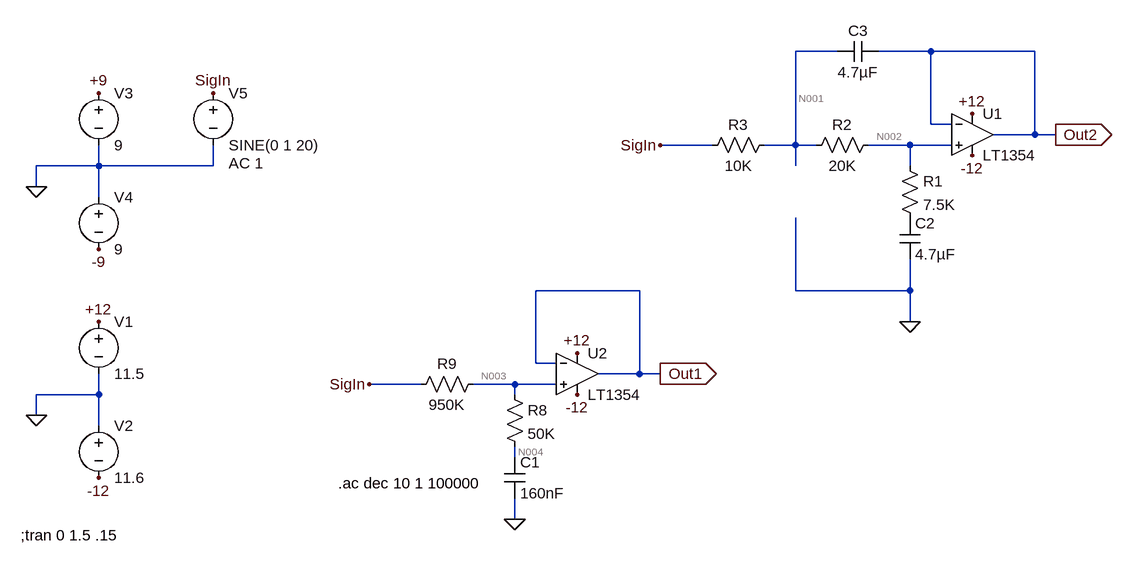
[diagram p0: schematic pll_loop_filt_active2.asc]
pll_loop_filt_active2.asc, the LTspice schematic file:
Version 4
SHEET 1 2008 1044
WIRE 832 48 768 48
WIRE 976 48 896 48
WIRE 1136 48 976 48
WIRE 976 160 976 48
WIRE 1008 160 976 160
WIRE 1136 176 1136 48
WIRE 1136 176 1072 176
WIRE 1168 176 1136 176
WIRE 640 192 560 192
WIRE 768 192 768 48
WIRE 768 192 720 192
WIRE 800 192 768 192
WIRE 944 192 880 192
WIRE 1008 192 944 192
WIRE -304 224 -304 192
WIRE -304 224 -400 224
WIRE -128 224 -128 192
WIRE -128 224 -304 224
WIRE 768 224 768 192
WIRE 944 224 944 192
WIRE -400 256 -400 224
WIRE -304 272 -304 224
WIRE 528 416 368 416
WIRE 768 416 768 304
WIRE 944 416 944 368
WIRE 944 416 768 416
WIRE 944 464 944 416
WIRE 368 528 368 416
WIRE 400 528 368 528
WIRE 528 544 528 416
WIRE 528 544 464 544
WIRE 560 544 528 544
WIRE 192 560 112 560
WIRE 336 560 272 560
WIRE 400 560 336 560
WIRE -304 576 -304 544
WIRE -304 576 -400 576
WIRE 336 576 336 560
WIRE -400 608 -400 576
WIRE -304 624 -304 576
WIRE 336 672 336 656
WIRE 336 768 336 736
FLAG -400 608 0
FLAG -304 464 +12
FLAG -304 704 -12
FLAG -400 256 0
FLAG -304 112 +9
FLAG -304 352 -9
FLAG -128 112 SigIn
FLAG 432 512 +12
FLAG 432 576 -12
FLAG 336 768 0
FLAG 112 560 SigIn
FLAG 560 544 Out1
IOPIN 560 544 Out
FLAG 1040 144 +12
FLAG 1040 208 -12
FLAG 944 464 0
FLAG 560 192 SigIn
FLAG 1168 176 Out2
IOPIN 1168 176 Out
SYMBOL voltage -304 448 R0
WINDOW 123 0 0 Left 0
WINDOW 39 0 0 Left 0
SYMATTR InstName V1
SYMATTR Value 11.5
SYMBOL voltage -304 608 R0
WINDOW 123 0 0 Left 0
WINDOW 39 0 0 Left 0
SYMATTR InstName V2
SYMATTR Value 11.6
SYMBOL voltage -304 96 R0
WINDOW 123 0 0 Left 0
WINDOW 39 0 0 Left 0
SYMATTR InstName V3
SYMATTR Value 9
SYMBOL voltage -304 256 R0
WINDOW 123 0 0 Left 0
WINDOW 39 0 0 Left 0
SYMATTR InstName V4
SYMATTR Value 9
SYMBOL voltage -128 96 R0
WINDOW 123 24 124 Left 2
WINDOW 39 0 0 Left 0
SYMATTR Value2 AC 1
SYMATTR InstName V5
SYMATTR Value SINE(0 1 20)
SYMBOL OpAmps\\LT1354 432 480 R0
SYMATTR InstName U2
SYMBOL res 320 560 R0
SYMATTR InstName R8
SYMATTR Value 50K
SYMBOL res 176 576 R270
WINDOW 0 32 56 VTop 2
WINDOW 3 0 56 VBottom 2
SYMATTR InstName R9
SYMATTR Value 950K
SYMBOL cap 320 672 R0
SYMATTR InstName C1
SYMATTR Value 160nF
SYMBOL OpAmps\\LT1354 1040 112 R0
SYMATTR InstName U1
SYMBOL res 928 208 R0
SYMATTR InstName R1
SYMATTR Value 7.5K
SYMBOL res 784 208 R270
WINDOW 0 32 56 VTop 2
WINDOW 3 0 56 VBottom 2
SYMATTR InstName R2
SYMATTR Value 20K
SYMBOL cap 928 304 R0
SYMATTR InstName C2
SYMATTR Value 4.7µF
SYMBOL res 624 208 R270
WINDOW 0 32 56 VTop 2
WINDOW 3 0 56 VBottom 2
SYMATTR InstName R3
SYMATTR Value 10K
SYMBOL cap 896 32 R90
WINDOW 0 0 32 VBottom 2
WINDOW 3 32 32 VTop 2
SYMATTR InstName C3
SYMATTR Value 4.7µF
TEXT -424 792 Left 2 !;tran 0 1.5 .15
TEXT 64 712 Left 2 !.ac dec 10 1 100000

The netlist it stands for:
* pll_loop_filt_active2.asc
V1 +12 0 11.5
V2 0 -12 11.6
V3 +9 0 9
V4 0 -9 9
V5 SigIn 0 SINE(0 1 20) AC 1
XU2 N003 Out1 +12 -12 Out1 LT1354  ; pins In+ In- V+ V- OUT
R8 N003 N004 50K
R9 SigIn N003 950K
C1 N004 0 160nF
XU1 N002 Out2 +12 -12 Out2 LT1354  ; pins In+ In- V+ V- OUT
R1 N002 P001 7.5K
R2 N001 N002 20K
C2 P001 0 4.7µF
R3 SigIn N001 10K
C3 Out2 N001 4.7µF
;tran 0 1.5 .15
.ac dec 10 1 100000
.backanno
.end

* Results of the author's LTspice run, read from the files saved beside the schematic
* Operating Point, zero values left out:
*   V(+12) = 11.5 V
*   V(-12) = -11.6 V
*   V(+9) = 9 V
*   V(-9) = -9 V
*   V(out1) = -76.41 mV
*   V(n003) = -76.41 mV
*   V(n004) = -76.41 mV
*   V(out2) = -2.428 mV
*   V(n002) = -2.427 mV
*   V(p001) = -2.427 mV
*   V(n001) = -809 µV
*   I(R3) = 80.9 nA
*   I(R2) = 80.9 nA
*   I(R9) = 80.43 nA
*   I(V5) = -161.3 nA
*   I(V2) = -1.988 mA
*   I(V1) = -1.988 mA
*   Ix(u2:1) = 80.43 nA
*   Ix(u2:2) = 80.44 nA
*   Ix(u2:3) = 994.2 µA
*   Ix(u2:4) = -994.2 µA
*   Ix(u2:5) = -80.43 nA
*   Ix(u1:1) = 80.9 nA
*   Ix(u1:2) = 80.9 nA
*   Ix(u1:3) = 994.2 µA
*   Ix(u1:4) = -994.2 µA
*   Ix(u1:5) = -80.9 nA
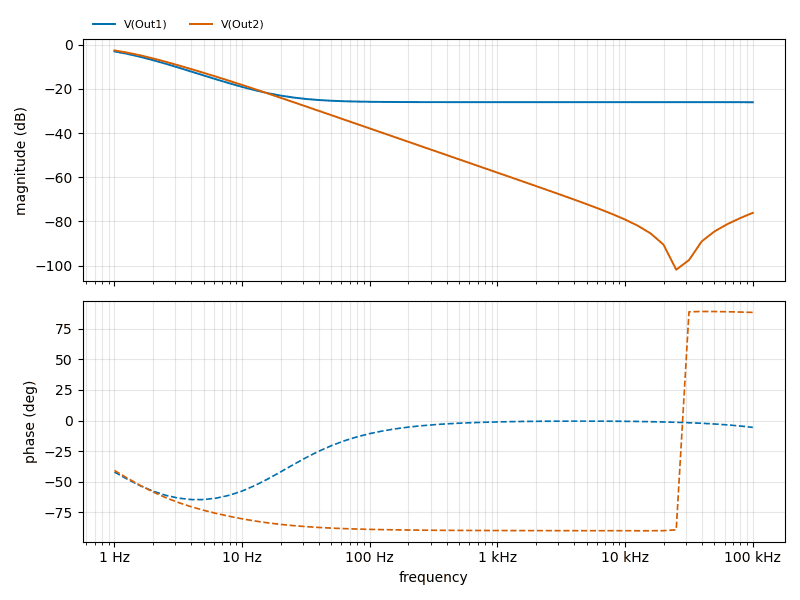
[diagram p1: AC Analysis of pll_loop_filt_active2.asc, plotted from the saved traces]
* AC Analysis, 1 run:
*   V(Out1): -3.05 dB at 1 Hz, -26.06 dB at 100 kHz, peak -3.05 dB at 1 Hz, 3 dB below the peak at 1.733 Hz
*   V(Out2): -2.60 dB at 1 Hz, -76.12 dB at 100 kHz, peak -2.60 dB at 1 Hz, 3 dB below the peak at 1.811 Hz